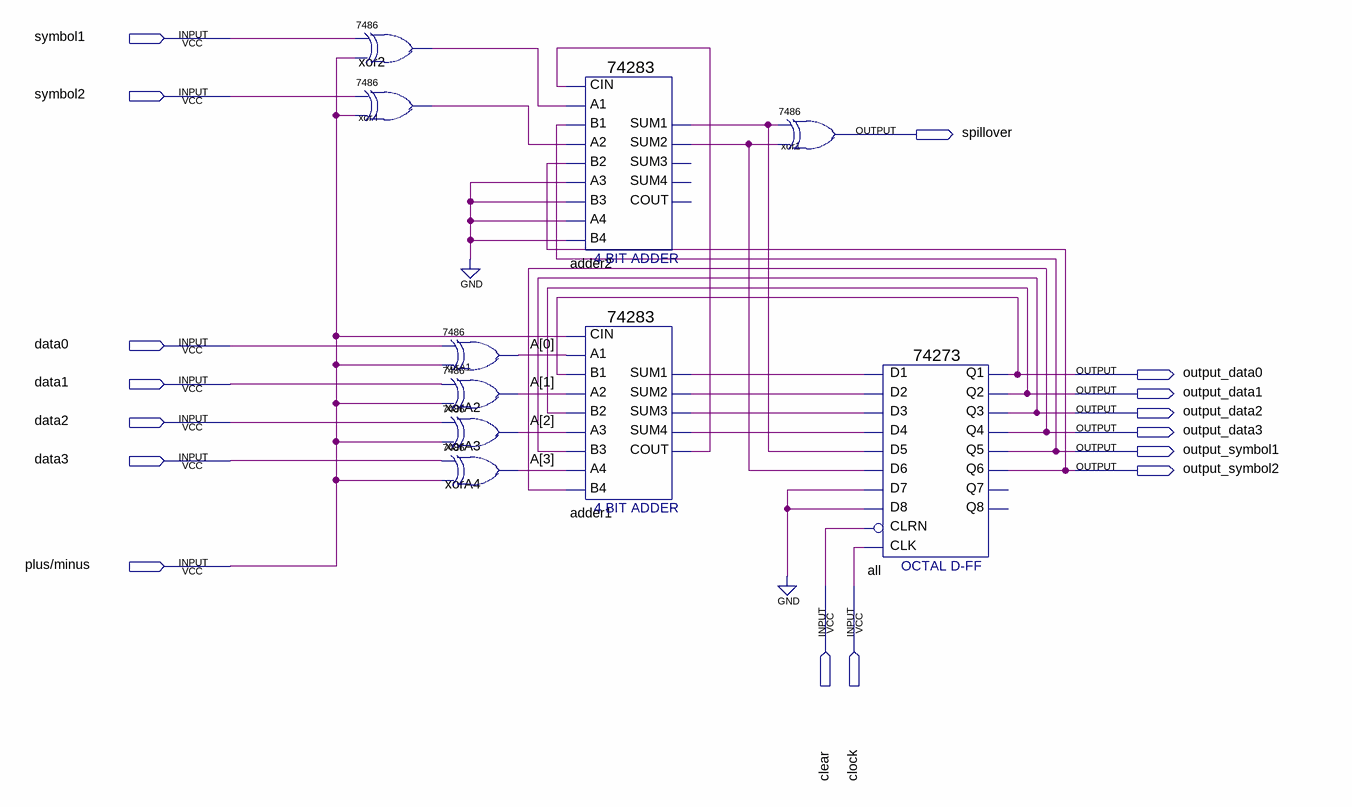
[diagram p0: schematic sheet]
// Quartus schematic experiment10.bdf as structural Verilog: 10 symbols, 16 pins
module experiment10 (
  input  symbol1,
  input  symbol2,
  input  data0,
  input  data1,
  input  data2,
  input  data3,
  input  \plus/minus ,
  input  clear,
  input  clock,
  output spillover,
  output output_data0,
  output output_data1,
  output output_data2,
  output output_data3,
  output output_symbol1,
  output output_symbol2
);

  wire adder1_cout, adder1_sum1, adder1_sum2, adder1_sum3, adder1_sum4, adder2_sum1, adder2_sum2, xor2_1,
       xor4_1;
  wire [3:0] A;

  \7486  xor2 (.\2 (symbol1), .\3 (\plus/minus ), .\1 (xor2_1));
  \7486  xor4 (.\2 (symbol2), .\3 (\plus/minus ), .\1 (xor4_1));
  \7486  xorA1 (.\2 (data0), .\3 (\plus/minus ), .\1 (A[0]));
  \7486  xorA2 (.\2 (data1), .\3 (\plus/minus ), .\1 (A[1]));
  \7486  xorA3 (.\2 (data2), .\3 (\plus/minus ), .\1 (A[2]));
  \7486  xorA4 (.\2 (data3), .\3 (\plus/minus ), .\1 (A[3]));
  \74283  adder2 (
    .CIN(adder1_cout), .A1(xor2_1), .A2(xor4_1), .B2(output_symbol2), .A3(1'b0), .A4(1'b0), .B4(1'b0),
    .B1(output_symbol1), .B3(1'b0), .SUM1(adder2_sum1), .SUM2(adder2_sum2));  // open: SUM4, COUT, SUM3
  \74283  adder1 (
    .CIN(\plus/minus ), .A1(A[0]), .A2(A[1]), .B2(output_data1), .A3(A[2]), .A4(A[3]), .B4(output_data3),
    .B1(output_data0), .B3(output_data2), .SUM4(adder1_sum4), .COUT(adder1_cout), .SUM1(adder1_sum1),
    .SUM2(adder1_sum2), .SUM3(adder1_sum3));
  \7486  xor1 (.\2 (adder2_sum1), .\3 (adder2_sum2), .\1 (spillover));
  \74273  all (
    .D2(adder1_sum2), .D3(adder1_sum3), .D1(adder1_sum1), .D4(adder1_sum4), .D7(1'b0), .D6(adder2_sum2),
    .D5(adder2_sum1), .D8(1'b0), .CLK(clock), .CLRN(clear), .Q4(output_data3), .Q1(output_data0),
    .Q2(output_data1), .Q3(output_data2), .Q6(output_symbol2), .Q5(output_symbol1));  // open: Q7, Q8
endmodule
